# Altium schematic sheet MCU.SchDoc: STM32 microcontroller IOs
size 420 x 297 mm; CompanyName: STMicroelectronics; Organization: Microcontrollers Division; DocumentNumber: 4; SheetNumber: 3; SheetTotal: 19
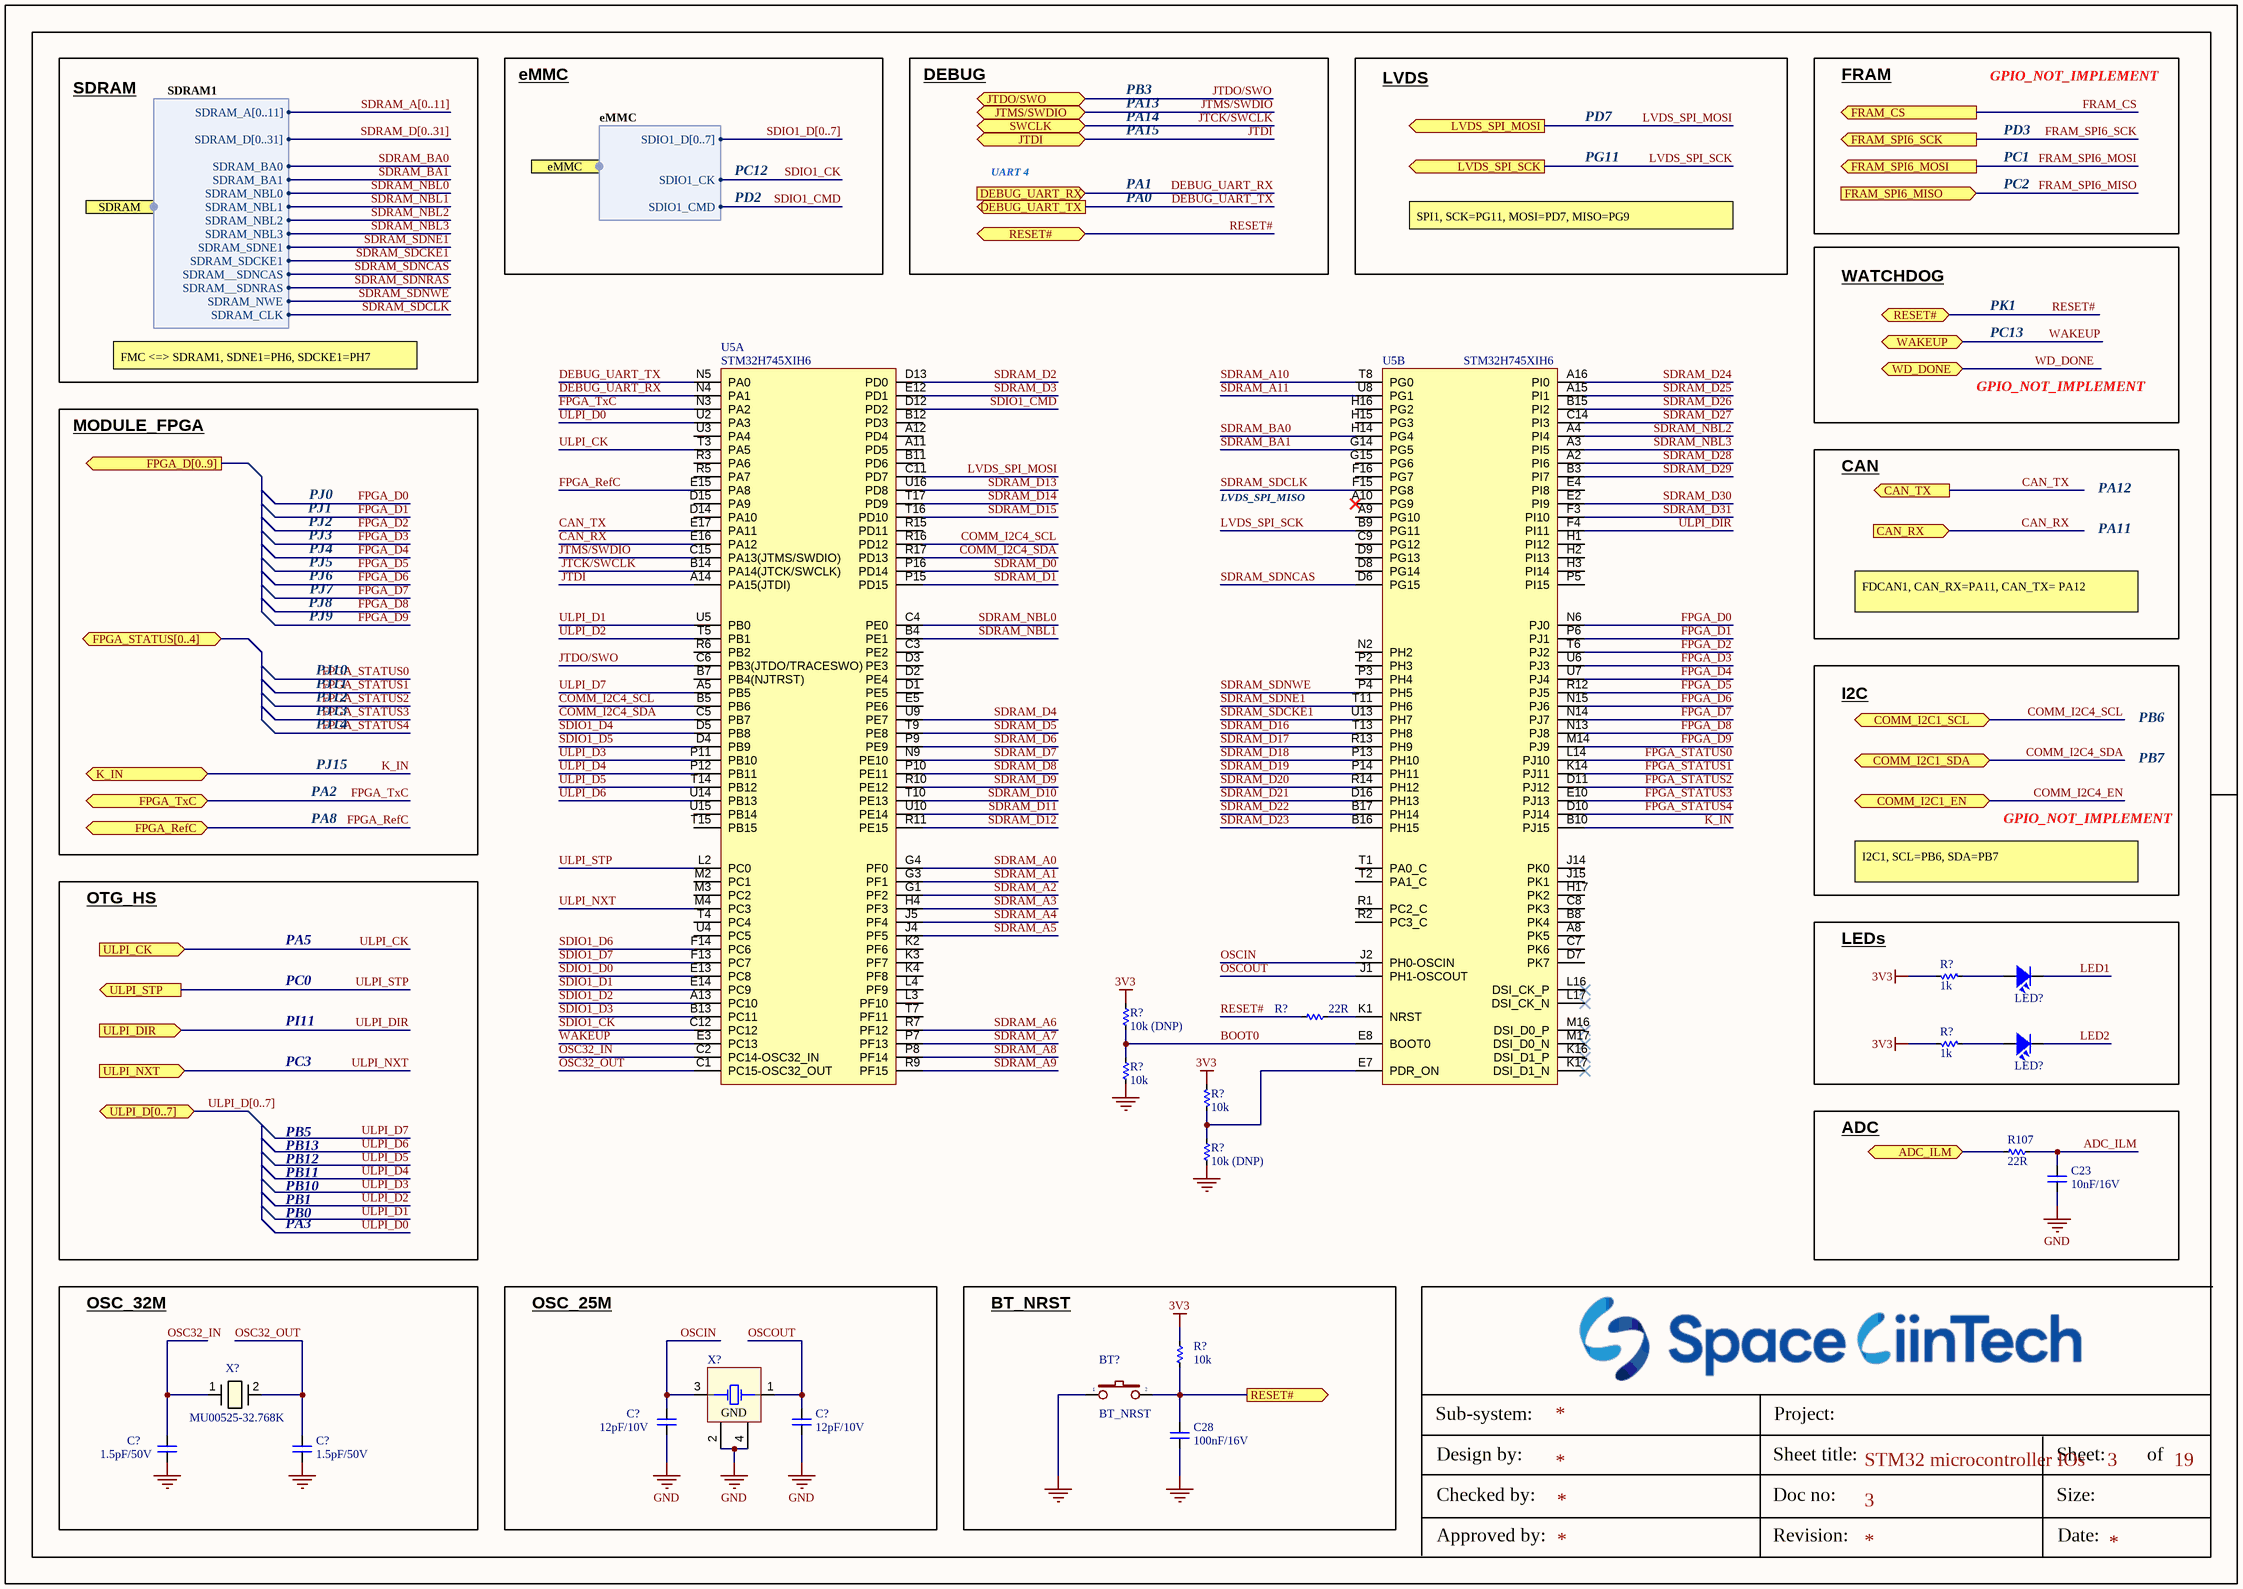
[diagram p0: MCU.SchDoc]

## Parts
(Parts that share a designator on the sheet are numbered #1, #2 ... from top to bottom, then left to right.)
BT?  BT_NRST  [SW2-SMD]
C23  10nF/16V  [CAP_C_1608X80]
C28  100nF/16V  [CAP_C_1608X80]
C?#1  12pF/10V  [CAP_C_1608X80]
C?#2  12pF/10V  [CAP_C_1608X80]
C?#3  1.5pF/50V  [CAP_C_1608X80]
C?#4  1.5pF/50V  [CAP_C_1608X80]
LED?#1  LED  [LED_0603]  (value not drawn)
LED?#2  LED  [LED_0603]  (value not drawn)
R107  22R  [RES_C_1608X60]
R?#1  1k  [RES_C_1608X60]
R?#2  10k (DNP)  [RES_C_1608X60]
R?#3  22R  [RES_C_1608X60]
R?#4  1k  [RES_C_1608X60]
R?#5  10k  [RES_C_1608X60]
R?#6  10k  [RES_C_1608X60]
R?#7  10k (DNP)  [RES_C_1608X60]
R?#8  10k  [RES_C_1608X60]
U5  value STM32H745XIH6  [TFBGA240+25]  (parts A,B of 3)
X?#1  MU00525-32.768K  [XTAL_MU00525_NDK]
X?#2  XT4  [XTAL_ECS-250-12-33Q-JES-TR]  (value not drawn)

## Blocks framed on the sheet
LEDs: LED?#1 LED?#2 R?#1 R?#4
ADC: C23 R107
OSC_32M: C?#3 C?#4 X?#1
OSC_25M: C?#1 C?#2 X?#2
BT_NRST: BT? C28 R?#8

## Ports
ADC_ILM (bidir), CAN_RX (in), CAN_TX (out), COMM_I2C1_EN (bidir), COMM_I2C1_SCL (bidir), COMM_I2C1_SDA (bidir), DEBUG_UART_RX (in), DEBUG_UART_TX (out), eMMC (harness eMMC), FPGA_D[0..9] (out), FPGA_RefC (bidir), FPGA_STATUS[0..4] (bidir), FPGA_TxC (bidir), FRAM_CS (out), FRAM_SPI6_MISO (in), FRAM_SPI6_MOSI (out), FRAM_SPI6_SCK (out), JTDI (bidir), JTDO/SWO (bidir), JTMS/SWDIO (bidir), K_IN (bidir), LVDS_SPI_MOSI (out), LVDS_SPI_SCK (out), RESET# (bidir), RESET# (out), SDRAM (harness SDRAM1), SWCLK (bidir), ULPI_CK (in), ULPI_D[0..7] (bidir), ULPI_DIR (in), ULPI_NXT (in), ULPI_STP (out), WAKEUP (bidir), WD_DONE (bidir)

## Harnesses
SDRAM1: SDRAM_A[0..11], SDRAM__SDNCAS, SDRAM_NBL0, SDRAM_SDNE1, SDRAM_SDCKE1, SDRAM_D[0..31], SDRAM_NBL1, SDRAM_BA0, SDRAM_BA1, SDRAM_NWE, SDRAM_CLK, SDRAM__SDNRAS, SDRAM_NBL3, SDRAM_NBL2
eMMC: SDIO1_D[0..7], SDIO1_CMD, SDIO1_CK

## Nets
3V3: R?#1.2 R?#2.1 R?#4.2 R?#6.1 R?#8.1
GND: BT?.1 C23.1 C28.1 C?#1.1 C?#2.1 C?#3.1 C?#4.1 R?#5.2 R?#7.2 X?#2.2(GND) X?#2.4(GND)
ADC_ILM: R107.1 ; port ADC_ILM
ADC_ILM: C23.2 R107.2  [a separate net that carries the same name]
BOOT0: R?#2.2 R?#5.1 U5.E8(BOOT0)
CAN_RX: U5.E16(PA12) ; port CAN_RX
CAN_TX: U5.E17(PA11) ; port CAN_TX
COMM_I2C4_EN: port COMM_I2C1_EN
COMM_I2C4_SCL: U5.B5(PB6) U5.R16(PD12) ; port COMM_I2C1_SCL
COMM_I2C4_SDA: U5.C5(PB7) U5.R17(PD13) ; port COMM_I2C1_SDA
DEBUG_UART_RX: U5.N4(PA1) ; port DEBUG_UART_RX
DEBUG_UART_TX: U5.N5(PA0) ; port DEBUG_UART_TX
FPGA_D0: U5.N6(PJ0)
FPGA_D1: U5.P6(PJ1)
FPGA_D2: U5.T6(PJ2)
FPGA_D3: U5.U6(PJ3)
FPGA_D4: U5.U7(PJ4)
FPGA_D5: U5.R12(PJ5)
FPGA_D6: U5.N15(PJ6)
FPGA_D7: U5.N14(PJ7)
FPGA_D8: U5.N13(PJ8)
FPGA_D9: U5.M14(PJ9)
FPGA_RefC: U5.E15(PA8) ; port FPGA_RefC
FPGA_STATUS0: U5.L14(PJ10)
FPGA_STATUS1: U5.K14(PJ11)
FPGA_STATUS2: U5.D11(PJ12)
FPGA_STATUS3: U5.E10(PJ13)
FPGA_STATUS4: U5.D10(PJ14)
FPGA_TxC: U5.N3(PA2) ; port FPGA_TxC
FRAM_CS: port FRAM_CS
FRAM_SPI6_MISO: port FRAM_SPI6_MISO
FRAM_SPI6_MOSI: port FRAM_SPI6_MOSI
FRAM_SPI6_SCK: port FRAM_SPI6_SCK
JTCK/SWCLK: U5.B14(PA14(JTCK/SWCLK)) ; port SWCLK
JTDI: U5.A14(PA15(JTDI)) ; port JTDI
JTDO/SWO: U5.C6(PB3(JTDO/TRACESWO)) ; port JTDO/SWO
JTMS/SWDIO: U5.C15(PA13(JTMS/SWDIO)) ; port JTMS/SWDIO
K_IN: U5.B10(PJ15) ; port K_IN
LED1: LED?#1.2
LED2: LED?#2.2
LVDS_SPI_MOSI: U5.C11(PD7) ; port LVDS_SPI_MOSI
LVDS_SPI_SCK: U5.B9(PG11) ; port LVDS_SPI_SCK
OSC32_IN: C?#3.2 U5.C2(PC14-OSC32_IN) X?#1.1
OSC32_OUT: C?#4.2 U5.C1(PC15-OSC32_OUT) X?#1.2
OSCIN: C?#1.2 U5.J2(PH0-OSCIN) X?#2.3(XTAL)
OSCOUT: C?#2.2 U5.J1(PH1-OSCOUT) X?#2.1(XTAL)
RESET#: BT?.2 C28.2 R?#3.1 R?#8.2 ; port RESET#
SDIO1_CK: U5.C12(PC12) ; port eMMC.SDIO1_CK
SDIO1_CMD: U5.D12(PD2) ; port eMMC.SDIO1_CMD
SDIO1_D0: U5.E13(PC8)
SDIO1_D1: U5.E14(PC9)
SDIO1_D2: U5.A13(PC10)
SDIO1_D3: U5.B13(PC11)
SDIO1_D4: U5.D5(PB8)
SDIO1_D5: U5.D4(PB9)
SDIO1_D6: U5.F14(PC6)
SDIO1_D7: U5.F13(PC7)
SDRAM_A0: U5.G4(PF0)
SDRAM_A1: U5.G3(PF1)
SDRAM_A2: U5.G1(PF2)
SDRAM_A3: U5.H4(PF3)
SDRAM_A4: U5.J5(PF4)
SDRAM_A5: U5.J4(PF5)
SDRAM_A6: U5.R7(PF12)
SDRAM_A7: U5.P7(PF13)
SDRAM_A8: U5.P8(PF14)
SDRAM_A9: U5.R9(PF15)
SDRAM_A10: U5.T8(PG0)
SDRAM_A11: U5.U8(PG1)
SDRAM_BA0: U5.H14(PG4) ; port SDRAM.SDRAM_BA0
SDRAM_BA1: U5.G14(PG5) ; port SDRAM.SDRAM_BA1
SDRAM_D0: U5.P16(PD14)
SDRAM_D1: U5.P15(PD15)
SDRAM_D2: U5.D13(PD0)
SDRAM_D3: U5.E12(PD1)
SDRAM_D4: U5.U9(PE7)
SDRAM_D5: U5.T9(PE8)
SDRAM_D6: U5.P9(PE9)
SDRAM_D7: U5.N9(PE10)
SDRAM_D8: U5.P10(PE11)
SDRAM_D9: U5.R10(PE12)
SDRAM_D10: U5.T10(PE13)
SDRAM_D11: U5.U10(PE14)
SDRAM_D12: U5.R11(PE15)
SDRAM_D13: U5.U16(PD8)
SDRAM_D14: U5.T17(PD9)
SDRAM_D15: U5.T16(PD10)
SDRAM_D16: U5.T13(PH8)
SDRAM_D17: U5.R13(PH9)
SDRAM_D18: U5.P13(PH10)
SDRAM_D19: U5.P14(PH11)
SDRAM_D20: U5.R14(PH12)
SDRAM_D21: U5.D16(PH13)
SDRAM_D22: U5.B17(PH14)
SDRAM_D23: U5.B16(PH15)
SDRAM_D24: U5.A16(PI0)
SDRAM_D25: U5.A15(PI1)
SDRAM_D26: U5.B15(PI2)
SDRAM_D27: U5.C14(PI3)
SDRAM_D28: U5.A2(PI6)
SDRAM_D29: U5.B3(PI7)
SDRAM_D30: U5.E2(PI9)
SDRAM_D31: U5.F3(PI10)
SDRAM_NBL0: U5.C4(PE0) ; port SDRAM.SDRAM_NBL0
SDRAM_NBL1: U5.B4(PE1) ; port SDRAM.SDRAM_NBL1
SDRAM_NBL2: U5.A4(PI4) ; port SDRAM.SDRAM_NBL2
SDRAM_NBL3: U5.A3(PI5) ; port SDRAM.SDRAM_NBL3
SDRAM_SDCKE1: U5.U13(PH7) ; port SDRAM.SDRAM_SDCKE1
SDRAM_SDCLK: U5.F15(PG8) ; port SDRAM.SDRAM_CLK
SDRAM_SDNCAS: U5.D6(PG15) ; port SDRAM.SDRAM__SDNCAS
SDRAM_SDNE1: U5.T11(PH6) ; port SDRAM.SDRAM_SDNE1
SDRAM_SDNRAS: port SDRAM.SDRAM__SDNRAS
SDRAM_SDNWE: U5.P4(PH5) ; port SDRAM.SDRAM_NWE
ULPI_CK: U5.T3(PA5) ; port ULPI_CK
ULPI_D0: U5.U2(PA3)
ULPI_D1: U5.U5(PB0)
ULPI_D2: U5.T5(PB1)
ULPI_D3: U5.P11(PB10)
ULPI_D4: U5.P12(PB11)
ULPI_D5: U5.T14(PB12)
ULPI_D6: U5.U14(PB13)
ULPI_D7: U5.A5(PB5)
ULPI_DIR: U5.F4(PI11) ; port ULPI_DIR
ULPI_NXT: U5.M4(PC3) ; port ULPI_NXT
ULPI_STP: U5.L2(PC0) ; port ULPI_STP
WAKEUP: U5.E3(PC13) ; port WAKEUP
WD_DONE: port WD_DONE
NetLED?#1_1: LED?#1.1 R?#1.1
NetLED?#2_1: LED?#2.1 R?#4.1
NetR?#3_2: R?#3.2 U5.K1(NRST)
NetR?#6_2: R?#6.2 R?#7.1 U5.E7(PDR_ON)

Not connected (* = marked no-connect by the designer): U5 A8(PK5) A9(PG10) A10(PG9)* A11(PD5) A12(PD4) B7(PB4(NJTRST)) B8(PK4) B11(PD6) B12(PD3) C3(PE2) C7(PK6) C8(PK3) C9(PG12) D1(PE5) D2(PE4) D3(PE3) D7(PK7) D8(PG14) D9(PG13) D14(PA10) D15(PA9) E4(PI8) E5(PE6) F16(PG7) G15(PG6) H1(PI12) H2(PI13) H3(PI14) H15(PG3) H16(PG2) H17(PK2) J14(PK0) J15(PK1) K2(PF6) K3(PF7) K4(PF8) K16(DSI_D1_P)* K17(DSI_D1_N)* L3(PF10) L4(PF9) L16(DSI_CK_P)* L17(DSI_CK_N)* M2(PC1) M3(PC2) M16(DSI_D0_P)* M17(DSI_D0_N)* N2(PH2) P2(PH3) P3(PH4) P5(PI15) R1(PC2_C) R2(PC3_C) R3(PA6) R5(PA7) R6(PB2) R15(PD11) T1(PA0_C) T2(PA1_C) T4(PC4) T7(PF11) T15(PB15) U3(PA4) U4(PC5) U15(PB14)

## Buses and harness runs
bus SDIO1_D[0..7]
bus SDRAM_A[0..11]
bus SDRAM_D[0..31]
bus ULPI_D[0..7] = port ULPI_D[0..7]

## Notes on the sheet
- SDRAM
- eMMC
- DEBUG
- PB3
- PA13
- PA14
- LVDS
- PD7
- FRAM
- GPIO_NOT_IMPLEMENT
- PC12
- UART 4
- PA15
- PA1
- PG11
- PC1
- PC2
- PD3
- PD2
- PA0
- SPI1, SCK=PG11, MOSI=PD7, MISO=PG9
- WATCHDOG
- PK1
- FMC <=> SDRAM1, SDNE1=PH6, SDCKE1=PH7
- PC13
- MODULE_FPGA
- PJ1
- PJ2
- PJ0
- LVDS_SPI_MISO
- CAN
- PA12
- PA11
- PJ3
- PJ4
- PJ5
- PJ6
- PJ7
- PJ8
- PJ9
- FDCAN1, CAN_RX=PA11, CAN_TX= PA12
- PJ10
- PJ11
- PJ12
- PJ13
- PJ14
- I2C
- PB6
- PA2
- PJ15
- PB7
- PA8
- OTG_HS
- I2C1, SCL=PB6, SDA=PB7
- PA5
- PC0
- PI11
- PC3
- PB5
- PB1
- PB10
- PB11
- PB12
- PB13
- PA3
- PB0
- Sub-system:
- Design by:
- Sheet title:
- Project:
- Sheet:
- of
- Checked by:
- Approved by:
- Doc no:
- Revision:
- Size:
- Date:

## Library data of the parts
BT? = BT2: Switch button 2 pin; Value: SW chip 2 pin
C23 C28 C?#1-C?#4 = CAP_SMD: CAP_Chip; Value: 33pF
LED?#1 LED?#2 = LED SMD: Value: LED 3 - 5 ly 2 Colour
R107 R?#2 R?#3 R?#5-R?#8 = _RES_B_2: RES
R?#1 = _RES_B_2: RES, 470R. 0603
R?#4 = _RES_B_2: RES, 47R. 0603
U5 = MCD-01085: 32bit MCU TFBGA240+25; Part_Type: IC; Manufacturer: STMICROELECTRONICS; BMS_Part_Number: 9175307; Manufacturer_HQ_COO: EU; Part_Preference: Recommended; Provided_By: STM; Initial_Board_Reference: MB1381; Component_Country_Of_Origin: Philippines; ID: 3408; ShowFields: YES; Internal_Part_Number: MCD-01085; Status: Checked; Manufacturer_Part_Number: STM32H745XIH6; Package: TFBGA-265; ComponentLink1Description: Datasheet; ComponentLink1URL: http://tunmcdsvn.tun.st.com/Component_Documentation_Library/Trunk/IC/STMICROELECTRONICS_STM32H745x; Order_Code_Digikey: 497-19502-ND; Order_Code_Farnell: 3365366; Order_Code_RS: N/A
X?#1 = MU00525-32.768K: 32.768 kHz ±20ppm Crystal 12.5pF 70 kOhms 2-SMD, No Lead; Manufacturer_Name: NDK; Type: Crystals; Copyright: Copyright (C) 2025 Ultra Librarian. All rights reserved.; Manufacturer_Part_Number: MU00525-32.768K
X?#2 = XT4: Crystal, 16 MHz, -30 to 85 degC, 3.2 x 2.5 x 0.9 mm SMD; Value: 4Mhz